# Altium schematic sheet EPS_Distribution_LCL-FPF.SchDoc: Distribution / LCL-FPF
size A4; SheetNumber: 51; SheetTotal: 51
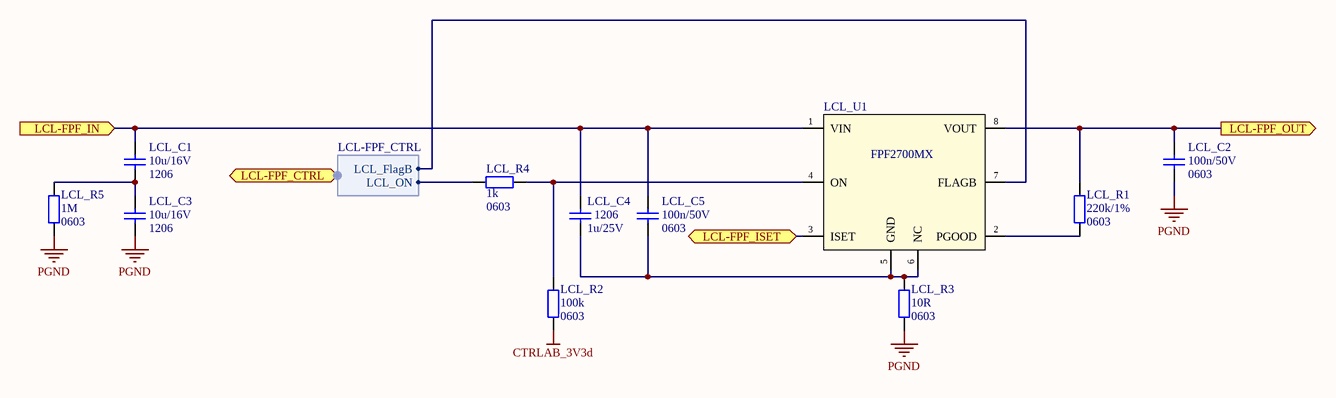
[diagram p0: EPS_Distribution_LCL-FPF.SchDoc]

## Parts
LCL_C1  Packge: 1206  [SMD_Capacitor_1206]  (hidden comment: 10u/16V)
LCL_C2  Package: 0603  [SMD_Capacitor_0603]  (hidden comment: 100n/50V)
LCL_C3  Packge: 1206  [SMD_Capacitor_1206]  (hidden comment: 10u/16V)
LCL_C4  Package: 1206  [SMD_Capacitor_1206]  (hidden comment: 1u/25V)
LCL_C5  Package: 0603  [SMD_Capacitor_0603]  (hidden comment: 100n/50V)
LCL_R1  Package: 0603  [SMD_Resistor_0603]  (hidden comment: 220k/1%)
LCL_R2  Package: 0603  [SMD_Resistor_0603]  (hidden comment: 100k)
LCL_R3  Package: 0603  [SMD_Resistor_0603]  (hidden comment: 10R)
LCL_R4  Package: 0603  [SMD_Resistor_0603]  (hidden comment: 1k)
LCL_R5  Package: 0603  [SMD_Resistor_0603]  (hidden comment: 1M)
LCL_U1  FPF2700MX  [SOIC-8-N]

## Ports
LCL-FPF_CTRL (harness LCL-FPF_CTRL), LCL-FPF_IN (in), LCL-FPF_ISET, LCL-FPF_OUT (out)

## Harnesses
LCL-FPF_CTRL: LCL_FlagB, LCL_ON

## Nets
CTRLAB_3V3d: LCL_R2.1
PGND: LCL_C2.2 LCL_C3.2 LCL_R3.1 LCL_R5.1
LCL-FPF_IN: LCL_C1.1 LCL_C4.1 LCL_C5.1 LCL_U1.1(VIN) ; port LCL-FPF_IN
LCL-FPF_ISET: LCL_U1.3(ISET) ; port LCL-FPF_ISET
LCL-FPF_OUT: LCL_C2.1 LCL_R1.2 LCL_U1.8(VOUT) ; port LCL-FPF_OUT
NetLCL_C1_2: LCL_C1.2 LCL_C3.1 LCL_R5.2
NetLCL_C4_2: LCL_C4.2 LCL_C5.2 LCL_R3.2 LCL_U1.5(GND) LCL_U1.6(NC)
NetLCL_R1_1: LCL_R1.1 LCL_U1.2(PGOOD)
NetLCL_R2_2: LCL_R2.2 LCL_R4.1 LCL_U1.4(ON)
NetLCL_R4_2: LCL_R4.2 ; port LCL-FPF_CTRL.LCL_ON
NetLCL_U1_7: LCL_U1.7(FLAGB) ; port LCL-FPF_CTRL.LCL_FlagB

## Notes on the sheet
- Title:
- Project:
- Author:
- Model:
- Document Number:
- Checked by:
- Rev:
- Date:
- Approved by:
- Sheet:
- of
- File name:

## Library data of the parts
LCL_C1 LCL_C3 = Cer_C1206T106K4RACTU: Ceramic Cap Kemet COTS 10u/16V X7R 1206; ManufacturerPartNumber: C1206T106K4RACTU; Manufacturer: Kemet; Value: 10u/16V
LCL_C2 LCL_C5 = Cer_C0603T104K5RALTU: Ceramic Cap Kemet COTS 100n/50V X7R 0603; Manufacturer: Kemet; ManufacturerPartNumber: C0603T104K5RALTU; Value: 100n/50V
LCL_C4 = Cer_C1206T105K3RALTU: Ceramic Cap Kemet COTS 1u/25V X7R 1206; ManufacturerPartNumber: C1206T105K3RALTU; Manufacturer: Kemet; Value: 1u/25V
LCL_R1-LCL_R5 = Res
  LCL_R1: Value: 220k/1%
  LCL_R2: Value: 100k
  LCL_R3: Value: 10R
  LCL_R4: Value: 1k
  LCL_R5: Value: 1M
LCL_U1 = FPF2700MX: Adj over-current protection 0.4-2A, Load Switch; Manufacturer: Fairchild Semiconductor; Value: FPF2700MX